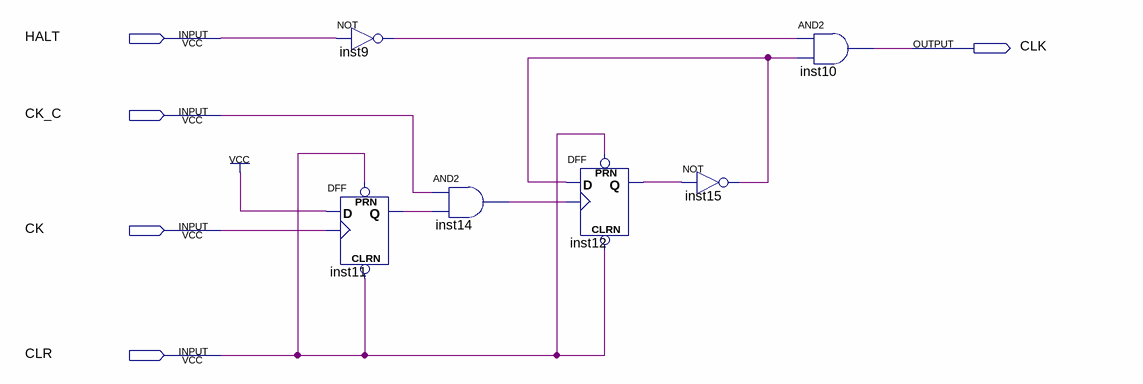
[diagram p0: schematic sheet]
// Quartus schematic Start.bdf as structural Verilog: 6 symbols, 5 pins
module Start (
  input  HALT,
  input  CK_C,
  input  CK,
  input  CLR,
  output CLK
);

  wire inst9_out, inst11_q, inst12_q, inst14_out, inst15_out;

  DFF inst11 (.CLRN(CLR), .CLK(CK), .D(1'b1), .PRN(CLR), .Q(inst11_q));
  not inst9 (inst9_out, HALT);
  and inst14 (inst14_out, CK_C, inst11_q);
  DFF inst12 (.CLRN(CLR), .CLK(inst14_out), .D(inst15_out), .PRN(CLR), .Q(inst12_q));
  not inst15 (inst15_out, inst12_q);
  and inst10 (CLK, inst9_out, inst15_out);
endmodule
